# EAGLE design pylontec_LAN_interface (EAGLE 9.6.2)
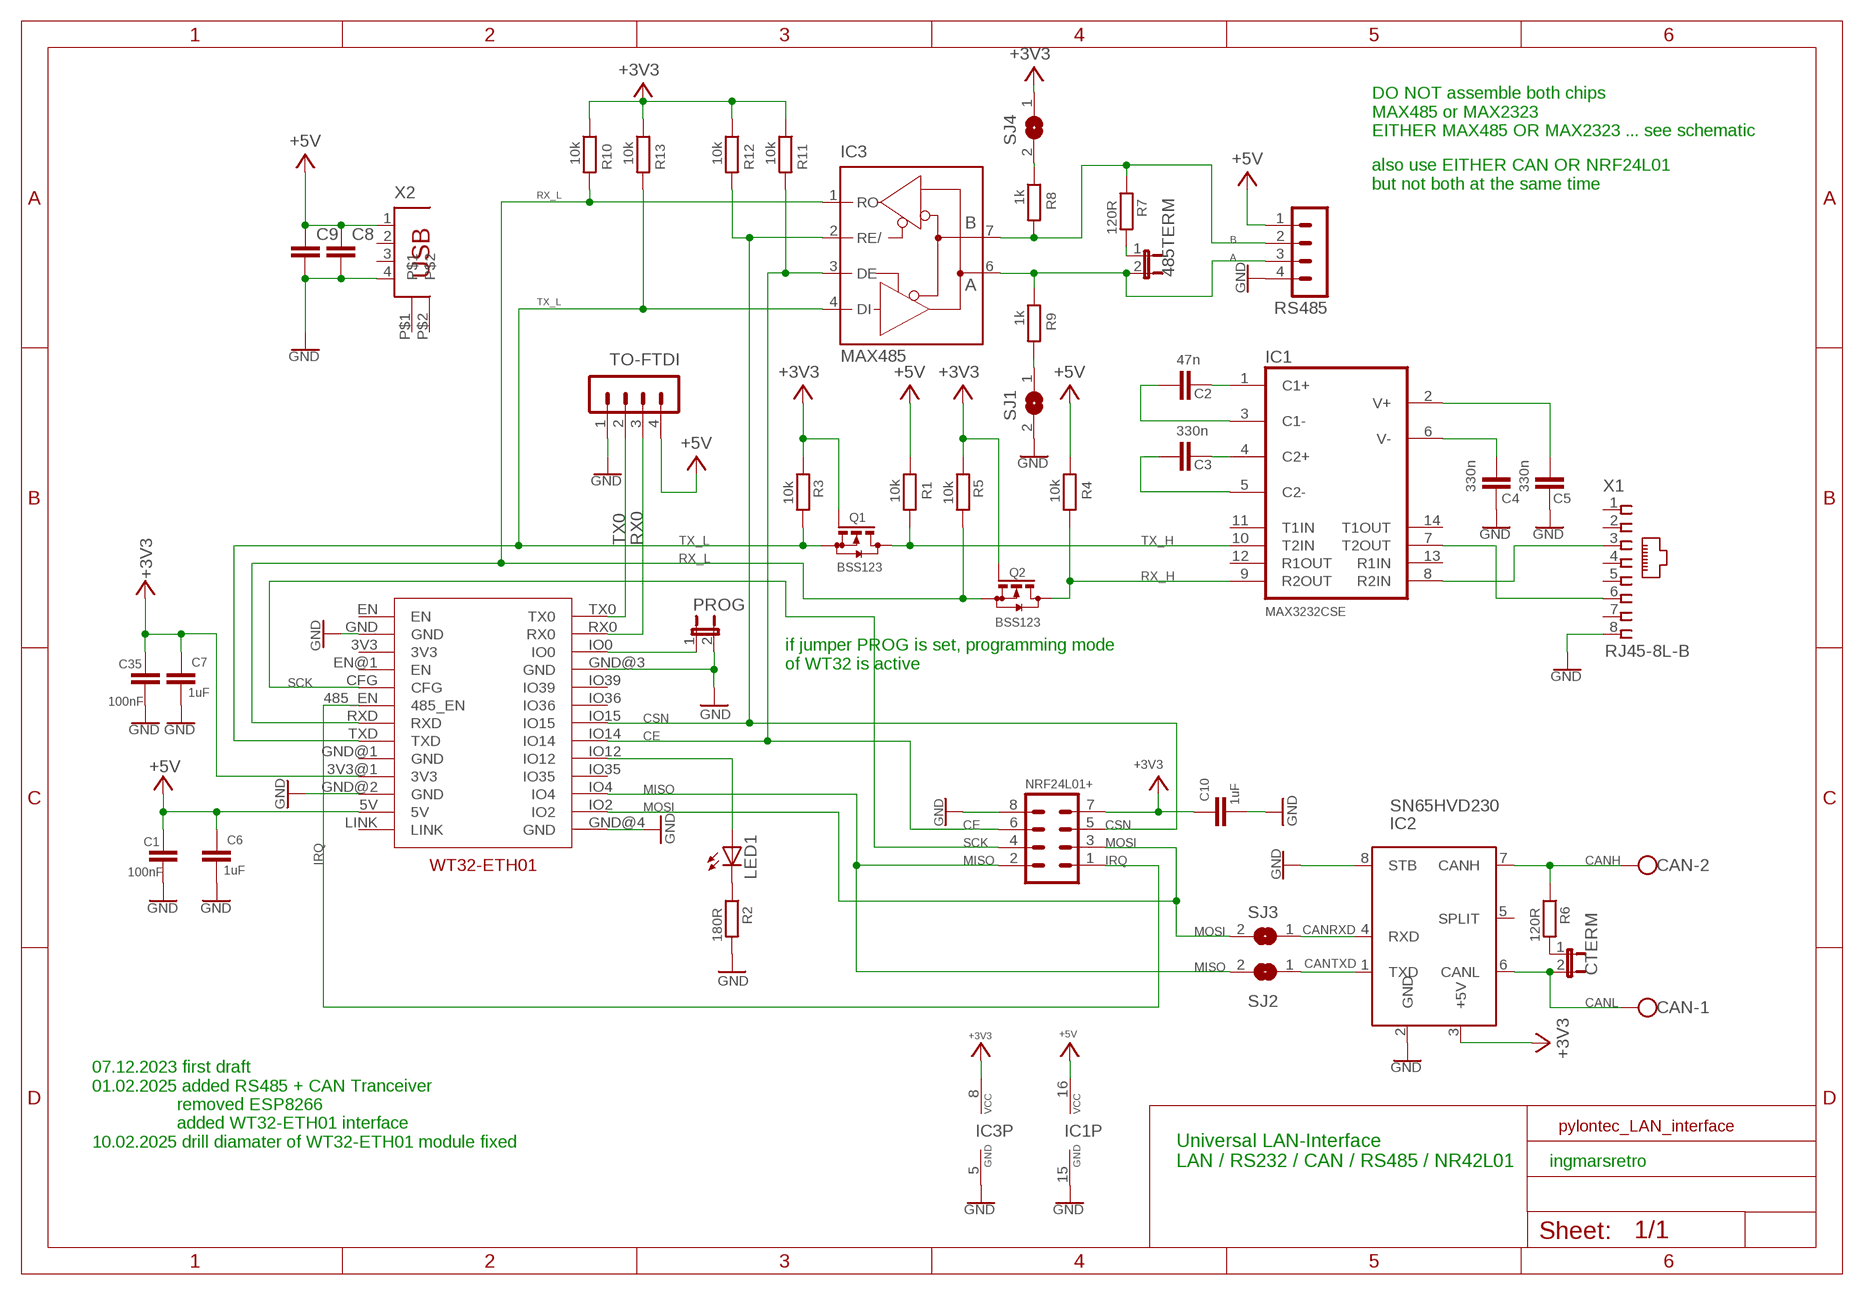
[diagram p0: schematic, sheet 1]

## Parts
485TERM  JP1E  [JP1]
C1  100nF  C-EUC0805  [C0805]
C2  47n  C-EUC0805  [C0805]
C3  330n  C-EUC0805  [C0805]
C4  330n  C-EUC0805  [C0805]
C5  330n  C-EUC0805  [C0805]
C6  1uF  C-EUC1210  [C1210]
C7  1uF  C-EUC1210  [C1210]
C8  C-EUC1210  [C1210]
C9  C-EUC1210  [C1210]
C10  1uF  C-EUC1210  [C1210]
C35  100nF  C-EUC0805  [C0805]
CAN  W237-102  [W237-102]
CTERM  JP1E  [JP1]
IC1  MAX3232CSE  [SO16]
IC2  SN65HVD230  TJA1040  [SO8]
IC3  MAX485  MAX481CSA  [SO08]
LED1  LED_LEDCHIPLED_0805  [LED_CHIPLED_0805]
NRF24L01+  MA04-2  [MA04-2]
PROG  JP1E  [JP1]
Q1  BSS123  [SOT23]
Q2  BSS123  [SOT23]
R1  10k  R-EU_R0805  [R0805]
R2  180R  R-EU_R0805  [R0805]
R3  10k  R-EU_R0805  [R0805]
R4  10k  R-EU_R0805  [R0805]
R5  10k  R-EU_R0805  [R0805]
R6  120R  R-EU_R0805  [R0805]
R7  120R  R-EU_R0805  [R0805]
R8  1k  R-EU_R0805  [R0805]
R9  1k  R-EU_R0805  [R0805]
R10  10k  R-EU_R0805  [R0805]
R11  10k  R-EU_R0805  [R0805]
R12  10k  R-EU_R0805  [R0805]
R13  10k  R-EU_R0805  [R0805]
RS485  MA04-1  [MA04-1]
SJ1  SJ  [SJ]
SJ2  SJ  [SJ]
SJ3  SJ  [SJ]
SJ4  SJ  [SJ]
TO-FTDI  MA04-1  [MA04-1]
U$2  WT32-ETH01  [WT32-ETH01]
X1  RJ45-8L-B  [RJ45-NO-SHIELD]
X2  SMARTPRJ_PN61729  [SMARTPRJ_PN61729]

## Nets
+3V3: C7.1 C10.1 C35.2 IC2.3(+5V) IC3.8(VCC) NRF24L01+.7 Q1.1(G) Q2.1(G) R3.1 R5.1 R10.1 R11.1 R12.1 R13.1 SJ4.1 U$2.3V3@1(3V3)
+5V: C1.2 C6.1 C8.1 C9.1 IC1.16(VCC) R1.1 R4.1 RS485.1 TO-FTDI.4 U$2.5V X2.1
A: 485TERM.2 IC3.6(A) R9.1 RS485.3
B: IC3.7(B) R7.1 R8.2 RS485.2
CANH: CAN.2 IC2.7(CANH) R6.1
CANL: CAN.1 CTERM.2 IC2.6(CANL)
CANRXD: IC2.4(RXD) SJ3.1
CANTXD: IC2.1(TXD) SJ2.1
CE: IC3.3(DE) NRF24L01+.6 R11.2 U$2.IO14
CSN: IC3.2(RE/) NRF24L01+.5 R12.2 U$2.IO15
GND: C1.1 C4.2 C5.2 C6.2 C7.2 C8.2 C9.2 C10.2 C35.1 IC1.15(GND) IC2.2(GND) IC2.8(STB) IC3.5(GND) NRF24L01+.8 PROG.2 R2.2 RS485.4 SJ1.2 TO-FTDI.1 U$2.GND U$2.GND@2(GND) U$2.GND@3(GND) U$2.GND@4(GND) X1.8 X2.4
IRQ: NRF24L01+.1 U$2.485_EN
MISO: NRF24L01+.2 SJ2.2 U$2.IO4
MOSI: NRF24L01+.3 SJ3.2 U$2.IO2
N$1: IC1.8(R2IN) X1.3
N$2: C2.1 IC1.1(C1+)
N$3: PROG.1 U$2.IO0
N$4: C2.2 IC1.3(C1-)
N$5: C3.1 IC1.4(C2+)
N$6: C3.2 IC1.5(C2-)
N$7: C4.1 IC1.6(V-)
N$8: C5.1 IC1.2(V+)
N$9: IC1.7(T2OUT) X1.6
N$10: LED1.A U$2.IO12
N$11: LED1.C R2.1
N$12: 485TERM.1 R7.2
N$13: CTERM.1 R6.2
N$16: R9.2 SJ1.1
N$17: R8.1 SJ4.2
RX0: TO-FTDI.3 U$2.RX0
RX_H: IC1.9(R2OUT) Q2.3(D) R4.2
RX_L: IC3.1(RO) Q2.2(S) R5.2 R10.2 U$2.RXD
SCK: NRF24L01+.4 U$2.CFG
TX0: TO-FTDI.2 U$2.TX0
TX_H: IC1.10(T2IN) Q1.3(D) R1.2
TX_L: IC3.4(DI) Q1.2(S) R3.2 R13.2 U$2.TXD
Unconnected: IC1.11(T1IN) IC1.12(R1OUT) IC1.13(R1IN) IC1.14(T1OUT) IC2.5(SPLIT) U$2.3V3 U$2.EN U$2.EN@1(EN) U$2.GND@1(GND) U$2.IO35 U$2.IO36 U$2.IO39 U$2.LINK X1.1 X1.2 X1.4 X1.5 X1.7 X2.2 X2.3 X2.P$1 X2.P$2

## Notes on the sheet
- DO NOT assemble both chips 
  MAX485 or MAX2323
  EITHER MAX485 OR MAX2323 ... see schematic
- also use EITHER CAN OR NRF24L01 
  but not both at the same time
- if jumper PROG is set, programming mode
  of WT32 is active
- Universal LAN-Interface
  LAN / RS232 / CAN / RS485 / NR42L01
- ingmarsretro
- 07.12.2023 first draft
  01.02.2025 added RS485 + CAN Tranceiver
                   removed ESP8266
                   added WT32-ETH01 interface
  10.02.2025 drill diamater of WT32-ETH01 module fixed

## Library data of the parts
485TERM CTERM PROG = jumper:JP1E: JUMPER
C1-C5 C35 = resistor:C-EU: CAPACITOR, European symbol
C6-C10 = rcl:C-EU: CAPACITOR, European symbol; SPICEPREFIX: C
CAN = con-wago-500:W237-102: WAGO SCREW CLAMP; MPN: 237-102; OC_FARNELL: unknown; OC_NEWARK: 70K9898
IC1 = maxim:MAX3232*: True RS-232 Transceivers 3.0V to 5.5V, Low-Power up to 1Mbps, Using Four 0.1µF External Capacitors Source: http://pdfserv.maxim-ic.com/en/ds/MAX3222-MAX3241.pdf; MPN: MAX3232CSE; OC_FARNELL: 9725490; OC_NEWARK: 90C2890
IC2 = nxp:TJA1040
IC3 = maxim:MAX481CSA: RS485 TRANSEIVER; MF: MAXIM; MPN: MAX481CSA; OC_FARNELL: unknown; OC_NEWARK: 90C3817
LED1 = arduino_Uno_ref:LED_LED: LED OSRAM: - CHIPLED LG R971, LG N971, LY N971, LG Q971, LY Q971, LO R971, LY R971 LH N974, LH R974 LS Q976, LO Q976, LY Q976 LO Q996 - Hyper CHIPLED LW Q18S LB Q993, LB Q99A, LB R99A - SideLED LS A670, LO A670, LY A670, LG A670, LP A670 LB A673, LV A673, LT A673, LW A673 LH A674 LY A675 LS A676, LA A676, LO A676, LY A676, LW A676 LS A679, LY A679, LG A679 - Hyper Micro SIDELED® LS Y876, LA Y876, LO Y876, LY Y876 LT Y87S - SmartLED LW L88C, LW L88S LB L89C, LB L89S, LG L890 LS L89K, LO L89K, LY L89K LS L896, LA L896, LO L896, LY L896 - TOPLED LS T670, LO T670, LY T670, LG T670, LP T670 LSG T670, LSP T670, LSY T670, LOP T670, LYG T670 LG T671, LOG T671, LSG T671 LB T673, LV T673, LT T673, LW T673 LH T674 LS T676, LA T676, LO T676, LY T676, LB T676, LH T676, LSB T676, LW T676 LB T67C, LV T67C, LT T67C, LS T67K, LO T67K, LY T67K, LW E67C LS E67B, LA E67B, LO E67B, LY E67B, LB E67C, LV E67C, LT E67C LW T67C LS T679, LY T679, LG T679 LS T770, LO T770, LY T770, LG T770, LP T770 LB T773, LV T773, LT T773, LW T773 LH T774 LS E675, LA E675, LY E675, LS T675 LS T776, LA T776, LO T776, LY T776, LB T776 LHGB T686 LT T68C, LB T68C - Hyper Mini TOPLED® LB M676 - Mini TOPLED Santana® LG M470 LS M47K, LO M47K, LY M47K Source: http://www.osram.convergy.de LUXEON: - LUMILED® LXK2-PW12-R00, LXK2-PW12-S00, LXK2-PW14-U00, LXK2-PW14-V00 LXK2-PM12-R00, LXK2-PM12-S00, LXK2-PM14-U00 LXK2-PE12-Q00, LXK2-PE12-R00, LXK2-PE12-S00, LXK2-PE14-T00, LXK2-PE14-U00 LXK2-PB12-K00, LXK2-PB12-L00, LXK2-PB12-M00, LXK2-PB14-N00, LXK2-PB14-P00, LXK2-PB14-Q00 LXK2-PR12-L00, LXK2-PR12-M00, LXK2-PR14-Q00, LXK2-PR14-R00 LXK2-PD12-Q00, LXK2-PD12-R00, LXK2-PD12-S00 LXK2-PH12-R00, LXK2-PH12-S00 LXK2-PL12-P00, LXK2-PL12-Q00, LXK2-PL12-R00 Source: www.luxeon.com KINGBRIGHT: KA-3528ASYC Source: www.kingbright.com
NRF24L01+ = con-lstb:MA04-2: PIN HEADER; OC_FARNELL: unknown; OC_NEWARK: unknown
Q1 Q2 = transistor-small-signal:BSS123: N-CHANNEL MOS FET
R1-R13 = resistor:R-EU_: RESISTOR, European symbol
RS485 TO-FTDI = con-lstb:MA04-1: PIN HEADER; OC_FARNELL: unknown; OC_NEWARK: unknown
SJ1-SJ4 = jumper:SJ: SMD solder JUMPER
U$2 = WT32-ETH01:WT32-ETH01: Check availability <https://pricing.snapeda.com/parts/WT32-ETH01/wireless-tag/view-part?ref=eda>; AVAILABILITY: Not in stock; CHECK_PRICES: https://www.snapeda.com/parts/WT32-ETH01/Wireless-Tag/view-part/?ref=eda; DESCRIPTION: Embedded serial port to Ethernet module; MF: wireless-tag; MP: WT32-ETH01; PACKAGE: None; PRICE: None; SNAPEDA_LINK: https://www.snapeda.com/parts/WT32-ETH01/Wireless-Tag/view-part/?ref=snap
X1 = con-tycoelectronics:RJ45: CORCOM Modular RJ Jacks No Shield Source: www.tycoelectronics.com .. ENG_DS_1654001_1099_RJ_L_0507.pdf; MF: TYCO ELECTRONICS; MPN: RJ45-8L-B; OC_FARNELL: 1279843; OC_NEWARK: 52K4445
X2 = arduino_Uno_ref:SMARTPRJ_PN61729: BERG USB connector

## Board
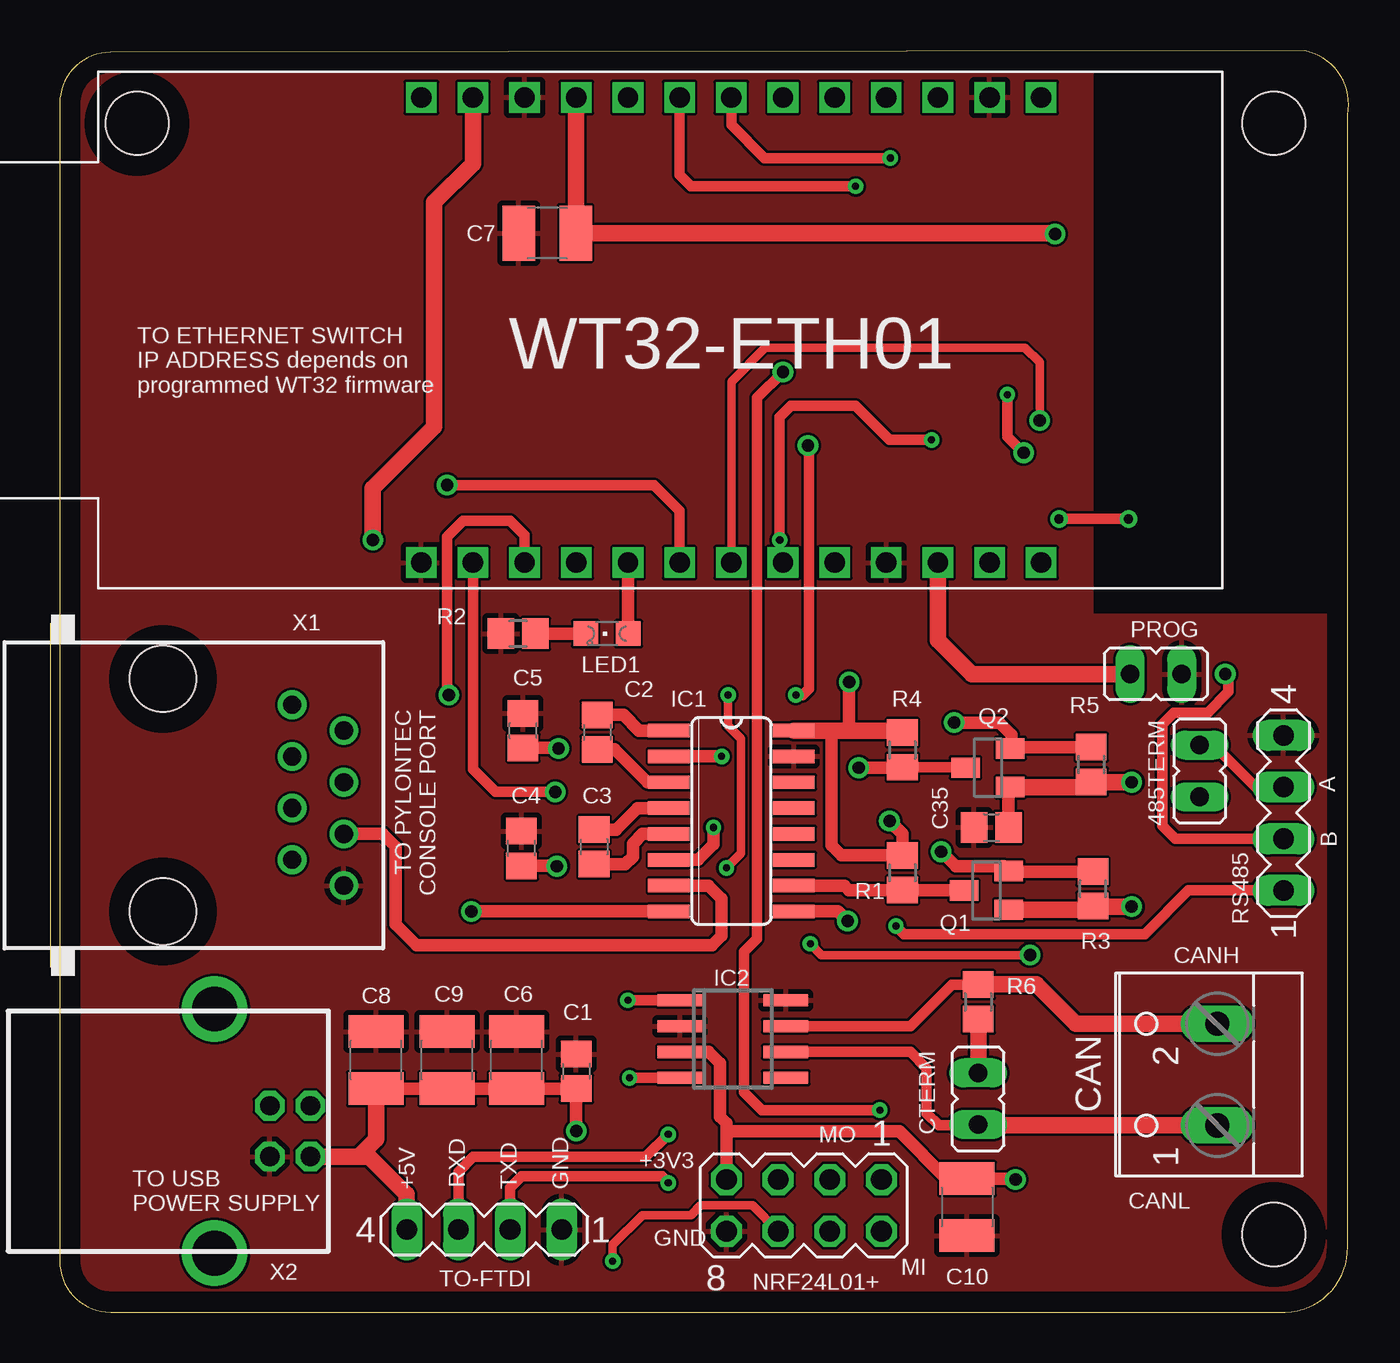
[diagram p1: board, top side]
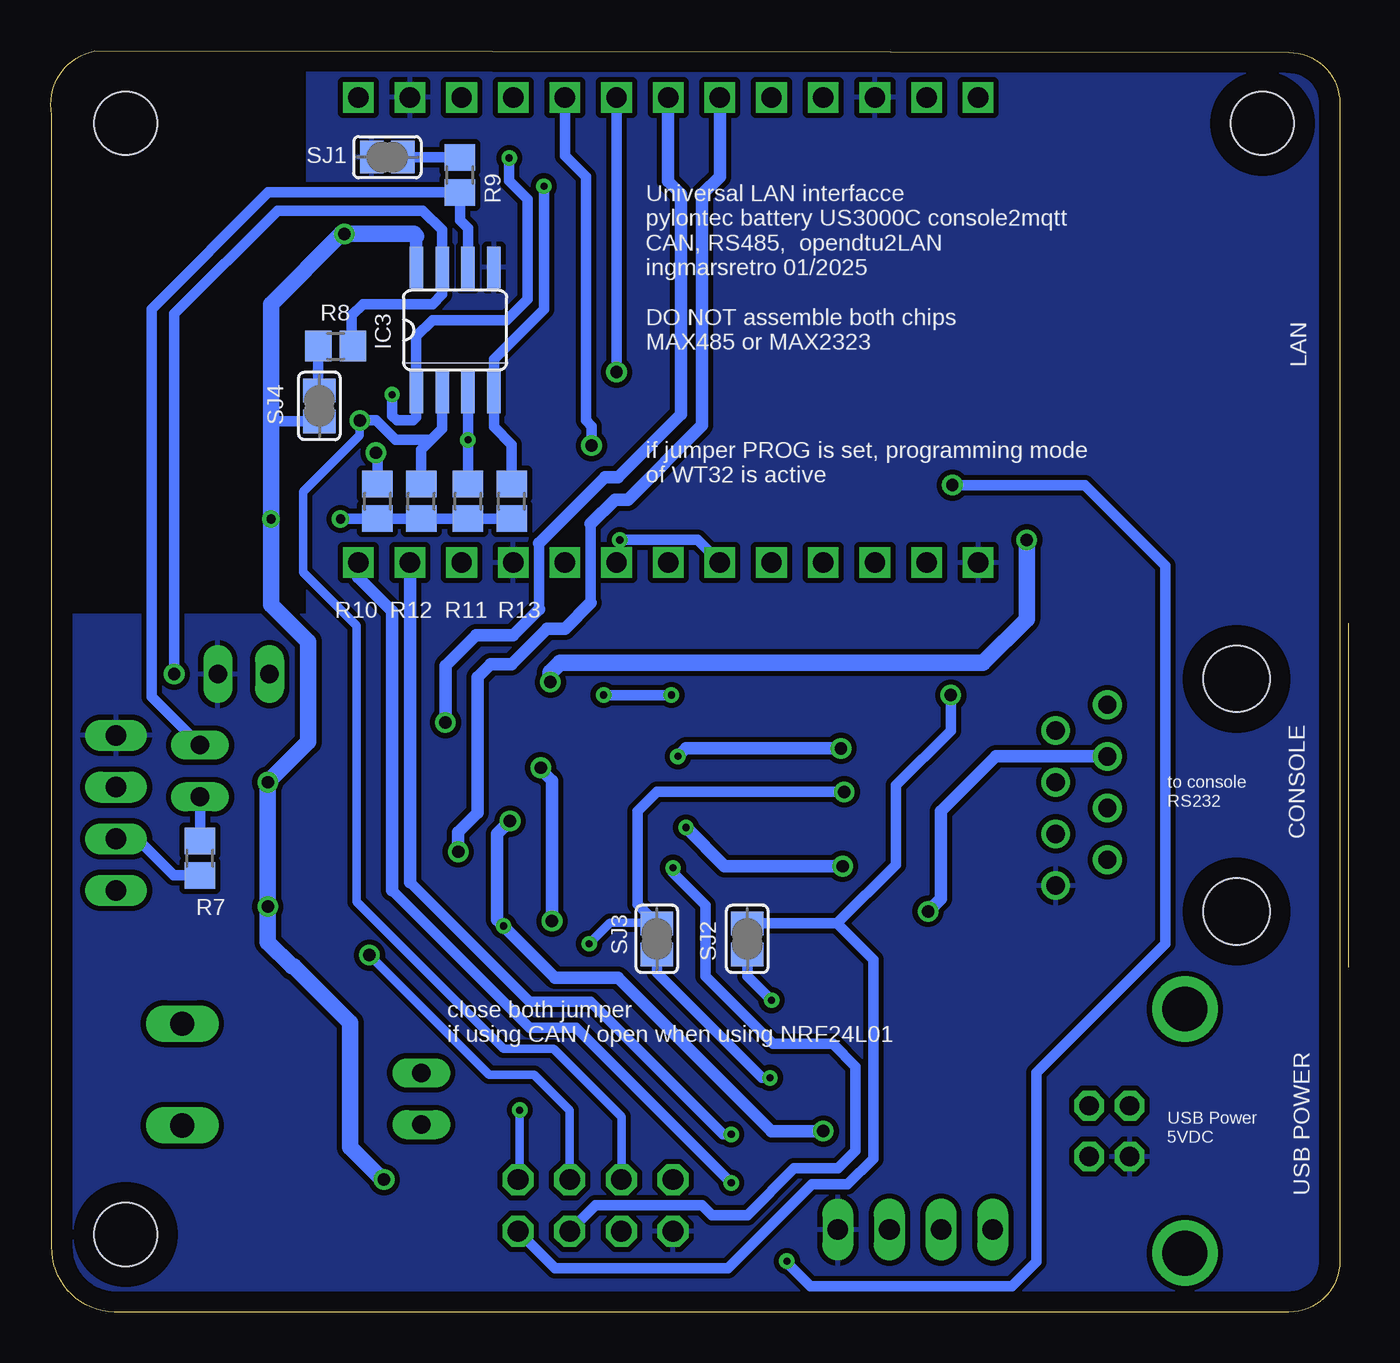
[diagram p2: board, bottom side, seen from below]

Size 63.37 x 61.98 mm. Coordinates in mm from the lower left corner, seen from the top.
Outline: 0,59.4 0,2.5 arc90 2.5,0 60.27,0 arc90 63.32,3.21 63.32,58.84 arc90 61.22,61.98 2.5,61.9 arc90 0,59.4
Copper layers (1*16): Top 0.035mm / dielectric 1.5mm / Bottom 0.035mm
Design rules "default *": minimum track width 10mil, minimum drill 24mil, track to track 5mil, track to pad 5mil, pad to pad 10mil, via to via 5mil, smd to smd 5mil, copper to edge 40mil, drill to drill 8mil, minimum pad ring 10mil, minimum via ring 8mil, stop-mask expansion 4mil, vias tented up to drill 0mil, thermal gap 10mil
Holes 3.1 mm at 59.69,3.81 59.69,58.42 3.81,58.42

### Footprints (pad centres in the part's own frame; a part is rotated, then mirrored left to right if it is on the bottom)
JP1 = drill 0.914 long: 1 0,-1.27; 2 0,1.27
C0805 = smd 1.3 x 1.5: 1 -0.85,0; 2 0.85,0
C1210 = smd 1.6 x 2.7: 1 -1.4,0; 2 1.4,0
W237-102 = drill 1.194 long: 1 -2.5,-1.27; 2 2.5,-1.27
SO16 = smd 0.66 x 2.032: 1 -4.445,-3.073; 2 -3.175,-3.073; 3 -1.905,-3.073; 4 -0.635,-3.073; 5 0.635,-3.073; 6 1.905,-3.073; 7 3.175,-3.073; 8 4.445,-3.073; 9 4.445,3.073; 10 3.175,3.073; 11 1.905,3.073; 12 0.635,3.073; 13 -0.635,3.073; 14 -1.905,3.073; 15 -3.175,3.073; 16 -4.445,3.073
SO8 = smd 0.6 x 2.2: 1 -1.905,-2.6; 2 -0.635,-2.6; 3 0.635,-2.6; 4 1.905,-2.6; 5 1.905,2.6; 6 0.635,2.6; 7 -0.635,2.6; 8 -1.905,2.6
SO08 = smd 0.66 x 2.032: 1 -1.905,-3.073; 2 -0.635,-3.073; 3 0.635,-3.073; 4 1.905,-3.073; 5 1.905,3.073; 6 0.635,3.073; 7 -0.635,3.073; 8 -1.905,3.073
LED_CHIPLED_0805 = smd 1.2 x 1.2: A 0,-1.05; C 0,1.05
MA04-2 = drill 1.016 octagon: 1 -3.81,-1.27; 2 -3.81,1.27; 3 -1.27,-1.27; 4 -1.27,1.27; 5 1.27,-1.27; 6 1.27,1.27; 7 3.81,-1.27; 8 3.81,1.27
SOT23 = smd 1 x 1.4: 1 -0.95,-1.1; 2 0.95,-1.1; 3 0,1.1
R0805 = smd 1.3 x 1.5: 1 -0.85,0; 2 0.85,0
MA04-1 = drill 1.016 long: 1 -3.81,0; 2 -1.27,0; 3 1.27,0; 4 3.81,0
SJ = smd 1.168 x 1.6: 1 -0.762,0; 2 0.762,0
WT32-ETH01 = drill 1 square: 3V3 0.635,-5.08; 3V3@1 0.635,-22.86; 5V 0.635,-27.94; 485_EN 0.635,-12.7; CFG 0.635,-10.16; EN 0.635,0; EN@1 0.635,-7.62; GND 0.635,-2.54; GND@1 0.635,-20.32; GND@2 0.635,-25.4; GND@3 23.495,-7.62; GND@4 23.495,-30.48; IO0 23.495,-5.08; IO2 23.495,-27.94; IO4 23.495,-25.4; IO12 23.495,-20.32; IO14 23.495,-17.78; IO15 23.495,-15.24; IO35 23.495,-22.86; IO36 23.495,-12.7; IO39 23.495,-10.16; LINK 0.635,-30.48; RX0 23.495,-2.54; RXD 0.635,-15.24; TX0 23.495,0; TXD 0.635,-17.78
RJ45-NO-SHIELD = drill 0.9 pad 1.4: 1 -4.445,6.35; 2 -3.175,8.89; 3 -1.905,6.35; 4 -0.635,8.89; 5 0.635,6.35; 6 1.905,8.89; 7 3.175,6.35; 8 4.445,8.89 | hole 3.251: -5.715,0; 5.715,0
SMARTPRJ_PN61729 = drill 0.95 octagon: 1 1.25,4.71; 2 -1.25,4.71; 3 -1.25,2.71; 4 1.25,2.71 | drill 2.2: P$1 -6,0; P$2 6,0

### Placement (x,y rotation side)
485TERM  56.04,26.59 0 top
C1  25.4,11.83 270 top
C2  26.43,28.5 270 top
C3  26.27,22.86 270 top
C4  22.7,22.78 90 top
C5  22.78,28.57 90 top
C6  22.46,12.38 90 top
C7  23.97,53.02 180 top
C8  15.56,12.38 90 top
C9  19.05,12.38 90 top
C10  44.61,5.16 270 top
C35  45.8,23.81 0 top
CAN  55.64,11.67 90 top
CTERM  45.16,10.48 180 top
IC1  33.02,24.13 270 top
IC2  33.1,13.41 270 top
IC3  43.5,48.26 0 bottom
LED1  26.91,33.34 90 top
NRF24L01+  36.59,5.24 180 top
PROG  53.9,31.35 270 top
Q1  45.56,20.72 90 top
Q2  45.64,26.75 90 top
R1  41.43,21.59 270 top
R2  22.54,33.34 180 top
R3  50.8,20.8 90 top
R4  41.43,27.62 270 top
R5  50.72,26.91 90 top
R6  45.16,15.24 270 top
R7  56.04,22.3 90 bottom
R8  49.37,47.47 0 bottom
R9  43.26,55.88 90 bottom
R10  47.31,39.85 90 bottom
R11  42.86,39.85 90 bottom
R12  45.16,39.85 90 bottom
R13  40.72,39.85 90 bottom
RS485  60.17,24.53 90 top
SJ1  46.83,56.75 180 bottom
SJ2  29.13,18.34 90 bottom
SJ3  33.58,18.34 90 bottom
SJ4  50.16,44.53 90 bottom
TO-FTDI  20.88,4.05 180 top
U$2  48.26,60.33 270 top
X1  5.08,25.4 270 top
X2  7.62,8.89 270 top

### Tracks (layer width: path | path; a pad name or v marks a point on that pad's centre or on a via)
+3V3  (via drill 0.45, 0.61)
  Top 0.508: v49.13,38.97 v52.55,38.97
  Top 0.61: C35.2 46.65,25.71 Q2.1 | IC2.3 31.91,12.78 32.46,12.22 32.46,9.6 32.78,9.29 32.78,8.89 | 32.78,8.89 NRF24L01+.7 | 32.78,8.89 41.27,8.89 43.61,6.56 C10.1 46.94,6.56 v46.99,6.51
  Top 0.813: Q2.1 50.46,25.8 R5.1 50.74,26.04 v52.7,26.04 | Q1.1 50.62,19.77 50.78,19.92 | 50.78,19.92 R3.1 | v52.7,19.92 50.78,19.92 | U$2.3V3@1 25.4,53.05 C7.1 48.82,53.02 48.9,52.94 v48.94,52.98
  Bottom 0.508: R13.1 R11.1 R12.1 R10.1 49.11,39 v49.13,38.97 | SJ4.1 52.51,43.77 52.55,43.74
  Bottom 0.61: 45.4,52.86 IC3.8
  Bottom 0.813: v46.99,6.51 47.07,6.51 48.66,8.1 48.66,14.21 51.44,16.99 51.51,16.99 52.7,18.18 v52.7,19.92 v52.7,26.04 50.72,28.02 50.72,32.94 52.55,34.77 v52.55,38.97 52.55,43.74 52.55,49.53 49.09,52.98 v48.94,52.98 45.52,52.98 45.4,52.86
+5V  (via drill 0.35, 0.61)
  Top 0.508: RS485.1 55.48,20.72 53.34,18.57 41.51,18.57 v41.12,18.97
  Top 0.61: 37.94,28.57 37.94,22.94 38.44,22.44 R1.1 41.43,23.5 v40.8,24.13 | v38.81,30.96 38.81,28.57 | C8.1 C9.1 C6.1 C1.2 v25.4,8.89
  Top 0.813: IC1.16 37.94,28.57 38.81,28.57 41.33,28.57 R4.1 | U$2.5V 20.32,56.44 18.41,54.53 18.41,43.5 15.4,40.48 v15.4,37.94 | X2.1 14.7,7.64 | C8.1 15.56,8.49 14.7,7.64 | TO-FTDI.4 17.07,5.79 15.22,7.64 14.7,7.64
  Bottom 0.61: v40.8,24.13 41.43,23.5 41.43,19.29 v41.12,18.97 38.58,16.43 35.48,16.43 27.94,8.89 v25.4,8.89
  Bottom 0.813: v15.4,37.94 15.4,34.05 17.54,31.91 38.34,31.91 38.81,31.43 v38.81,30.96
A
  Top 0.508: RS485.3 58.82,25.8 56.75,27.86 485TERM.2
  Bottom 0.508: IC3.6 42.86,53.26 43.26,53.66 R9.1 52.68,55.03 58.42,49.29 58.42,30.24 485TERM.2
B  (via drill 0.61)
  Top 0.508: v57.31,31.35 57.47,31.19 57.47,30.48 56.44,29.45 54.77,29.45 54.21,28.89 54.21,23.89 54.85,23.26 RS485.2 59.21,23.26
  Bottom 0.508: 60.09,23.18 RS485.2 59.13,23.26 57.33,21.45 R7.1 | R8.2 48.58,47.52 48.58,48.97 48.02,49.53 44.61,49.53 44.13,50.01 IC3.7 44.13,53.18 45.09,54.13 52.23,54.13 57.31,49.05 v57.31,31.35
CANH
  Top 0.508: IC2.7 41.83,14.05 43.87,16.09 R6.1
  Top 0.813: CAN.2 49.97,14.17 48.02,16.11 45.19,16.11 R6.1
CANL
  Top 0.508: IC2.6 41.83,12.78 42.62,11.99 42.62,9.76 43.22,9.17 45.2,9.17
  Top 0.813: CAN.1 45.2,9.17 CTERM.2
CANRXD  (via drill 0.35)
  Top 0.508: v28.02,11.51 IC2.4
  Bottom 0.508: SJ3.1 33.58,16.67 28.42,11.51 v28.02,11.51
CANTXD  (via drill 0.35)
  Top 0.508: v27.94,15.32 IC2.1
  Bottom 0.508: SJ2.1 29.13,16.51 v27.94,15.32
CE  (via drill 0.35, 0.61)
  Top 0.406: v27.19,2.5 27.19,3.29 28.65,4.76 31.04,4.76 31.51,5.24 34.05,5.24 NRF24L01+.6
  Top 0.508: U$2.IO14 30.48,39.37 29.21,40.64 v19.05,40.64 | v42.86,42.86 40.8,42.86 39.13,44.53 35.96,44.53 35.4,43.97 v35.4,37.94
  Bottom 0.508: v19.05,40.64 12.54,40.64 8.57,36.67 8.57,18.1 14.92,11.75 14.92,2.46 16.11,1.27 26.04,1.27 27.23,2.46 v27.19,2.5 | IC3.3 v42.86,42.86 R11.2 | v35.4,37.94 31.59,37.94 U$2.IO14
CSN  (via drill 0.61)
  Top 0.406: v48.18,43.81 48.18,46.67 47.47,47.39 34.69,47.39 33.02,45.72 U$2.IO15
  Bottom 0.406: NRF24L01+.5 35.32,9.6 38.66,12.94 41.12,12.94 48.34,20.16 48.34,33.73 50.96,36.35 50.96,40.32 48.18,43.1 v48.18,43.81
  Bottom 0.508: IC3.2 44.13,43.42 44.69,42.86 | 44.69,42.86 46.43,42.86 47.39,43.81 v48.18,43.81 | R12.2 45.16,42.39 44.69,42.86
GND
  pour Top: 63.26,0 2.5,0 arc-90 0,2.5 0,59.73 arc-90 2.5,62.23 50.8,62.23 50.8,34.29 63.26,34.29
  pour Bottom (isolate 0.254): 63.34,0 2.5,0 arc-90 0,2.5 0,59.73 arc-90 2.5,62.23 50.8,62.23 50.8,34.29 63.34,34.29
IRQ  (via drill 0.35, 0.61)
  Top 0.508: v35.56,46.2 34.29,44.93 34.29,18.34 33.66,17.7 33.66,10.79 34.53,9.92 v40.32,9.92
  Bottom 0.406: v40.32,9.92 40.32,6.59 NRF24L01+.1
  Bottom 0.508: U$2.485_EN v35.56,46.2
MISO  (via drill 0.61)
  Top 0.508: U$2.IO4 22.86,38.18 22.15,38.89 19.84,38.89 19.05,38.1 19.05,30.4 v19.13,30.32
  Bottom 0.508: SJ2.2 24.72,19.1 | v19.13,30.32 19.13,28.57 21.83,25.88 21.83,21.99 24.72,19.1 | NRF24L01+.2 38.58,2.14 30.08,2.14 25.96,6.27 24.21,6.27 22.94,7.54 22.94,17.32 24.72,19.1
MOSI  (via drill 0.35, 0.61)
  Top 0.406: v47.7,17.54 37.47,17.54 v36.91,18.1
  Top 0.508: v24.37,25.56 21.43,25.56 20.32,26.67 U$2.IO2
  Bottom 0.406: NRF24L01+.3 37.86,9.92 39.61,11.67 41.83,11.67 v47.7,17.54 | v36.91,18.1 35.88,19.13 33.61,19.13 33.59,19.11
  Bottom 0.508: v24.37,25.56 33.58,25.56 34.53,24.61 34.53,20.05 33.59,19.11 SJ3.2
N$1  (via drill 0.61)
  Top 0.61: v20.24,19.68 IC1.8
  Bottom 0.61: X1.3 16.91,27.3 19.61,24.61 19.61,20.32 v20.24,19.68
N$2
  Top 0.61: IC1.1 28.5,28.57 27.73,29.35 C2.1
N$3
  Top 0.813: PROG.1 44.85,31.35 43.18,33.02 U$2.IO0
N$4
  Top 0.61: IC1.3 28.89,26.04 27.28,27.65 C2.2
N$5
  Top 0.61: IC1.4 28.42,24.77 27.36,23.71 C3.1
N$6
  Top 0.61: IC1.5 28.65,23.5 28.18,23.02 28.18,22.38 27.8,22.01 C3.2
N$7  (via drill 0.35, 0.61)
  Top 0.61: C4.1 24.42,21.93 v24.45,21.91 | v32.15,23.81 32.15,23 31.38,22.23 IC1.6
  Bottom 0.61: v24.45,21.91 30.24,21.91 v32.15,23.81
N$8  (via drill 0.35, 0.61)
  Top 0.61: C5.1 24.5,27.73 v24.53,27.7 | v32.54,27.3 IC1.2
  Bottom 0.61: v24.53,27.7 32.15,27.7 v32.54,27.3
N$9
  Top 0.61: IC1.7 31.91,20.95 32.54,20.32 32.54,18.49 32.07,18.02 17.54,18.02 16.51,19.05 16.51,22.86 15.88,23.5 X1.6
N$10
  Top 0.61: LED1.A 27.94,33.36 U$2.IO12
N$11
  Top 0.61: R2.1 LED1.C
N$12
  Bottom 0.508: R7.2 485TERM.1
N$13
  Top 0.813: R6.2 CTERM.1
N$16
  Bottom 0.508: SJ1.1 43.28,56.75 R9.2
N$17
  Bottom 0.508: R8.1 50.22,45.35 SJ4.2
RX0  (via drill 0.35)
  Top 0.508: TO-FTDI.3 19.61,6.91 20.32,7.62 28.81,7.62 v29.92,8.73
  Bottom 0.508: 45.72,21.11 39.85,15.24 36.83,15.24 30.32,8.73 v29.92,8.73
  Bottom 0.61: U$2.RX0 45.72,21.11
RX_H  (via drill 0.61)
  Top 0.508: Q2.3 44.52,26.77 R4.2 41.41,26.75
  Top 0.61: IC1.9 38.26,19.68 v38.73,19.21 | 41.41,26.75 v39.29,26.75 | 41.46,26.75 R4.2
  Bottom 0.61: v38.73,19.21 38.73,26.11 39.29,26.67 v39.29,26.75
RX_L  (via drill 0.35, 0.61)
  Top 0.508: v40.84,56.71 34.65,56.71 33.02,58.34 U$2.RXD | v47.39,42.23 46.59,43.02 v46.59,45.09
  Top 0.61: R5.2 46.8,27.76 | 46.8,27.76 Q2.2 | 46.8,27.76 46.8,28.37 46.2,28.97 v43.97,28.97
  Bottom 0.508: 39.37,37.78 39.37,34.53 | v40.84,56.71 40.84,55.6 39.93,54.69 39.93,49.77 40.96,48.74 44.61,48.74 45.4,47.94 IC3.1 45.4,43.97 45.56,43.81 46.35,43.81 46.59,44.05 v46.59,45.09 | R10.2 47.31,42.07 47.39,42.15 v47.39,42.23
  Bottom 0.61: U$2.RXD 33.02,55.56 32.38,54.93 32.38,44.13 35.48,41.04 36.12,41.04 39.37,37.78 | 39.37,34.53 40.64,33.26 42.47,33.26 43.97,31.75 v43.97,28.97
SCK  (via drill 0.35, 0.61)
  Top 0.406: v32.86,30.32 32.86,28.81 33.5,28.18 33.5,22.54 v32.78,21.83
  Top 0.508: v36.79,42.59 36.83,42.55 36.83,30.64 36.51,30.32 v36.2,30.32
  Bottom 0.508: U$2.CFG 38.1,56.83 37.07,55.8 37.07,43.81 36.79,43.54 v36.79,42.59 | NRF24L01+.4 36.59,5.24 31.35,5.24 30.88,4.76 29.13,4.76 26.83,7.06 24.69,7.06 23.81,7.94 23.81,12.06 24.92,13.18 27.86,13.18 31.19,16.51 31.19,20 32.78,21.59 v32.78,21.83 | v36.2,30.32 v32.86,30.32
TX0  (via drill 0.35)
  Top 0.508: TO-FTDI.2 22.15,6.11 22.7,6.67 29.61,6.67 v29.92,6.35
  Bottom 0.508: 46.59,20.72 39.85,13.97 37.54,13.97 v29.92,6.35
  Bottom 0.61: 46.59,20.72 46.59,34.45 48.26,36.12 U$2.TX0
TX_H
  Top 0.61: Q1.3 41.46,20.72 | 41.46,20.72 R1.2 | IC1.10 38.58,20.95 38.81,20.72 41.46,20.72
TX_L  (via drill 0.35, 0.61)
  Top 0.508: v39.13,55.32 31.04,55.32 30.48,55.88 U$2.TXD
  Top 0.61: R3.2 46.68,21.65 Q1.2 46.42,21.91 44.05,21.91 v43.34,22.62
  Bottom 0.508: 36.83,38.73 36.83,34.85 | v39.13,55.32 39.13,49.29 41.59,46.83 IC3.4 41.59,43.5 40.72,42.62 R13.2
  Bottom 0.61: U$2.TXD 30.48,55.8 31.35,54.93 31.35,43.58 35,39.93 35.64,39.93 36.83,38.73 | 36.83,34.85 38.1,33.58 38.97,33.58 40.72,31.83 41.75,31.83 42.39,31.19 42.39,24.53 43.34,23.57 v43.34,22.62

### Text on the board
tNames: TO ETHERNET SWITCH / IP ADDRESS depends on / programmed WT32 firmware | TO PYLONTEC / CONSOLE PORT | A | B | CANH | MO | TO USB / POWER SUPPLY | +3V3 | +5V | RXD | TXD | GND | CANL | GND | MI
bNames: Universal LAN interfacce / pylontec battery US3000C console2mqtt / CAN, RS485, opendtu2LAN / ingmarsretro 01/2025 / / DO NOT assemble both chips / MAX485 or MAX2323 | LAN | if jumper PROG is set, programming mode / of WT32 is active | to console / RS232 | CONSOLE | close both jumper / if using CAN / open when using NRF24L01 | USB Power / 5VDC | USB POWER